# EasyEDA schematic SCH_A320 OVHD Lights_2023-04-26.json
TITLE: A320 Overhead - Lights; REV: 1.0; Date: 2021-09-25; Sheet: 1/1; Drawn By: MadMonkeyFPV\nShane Sewell
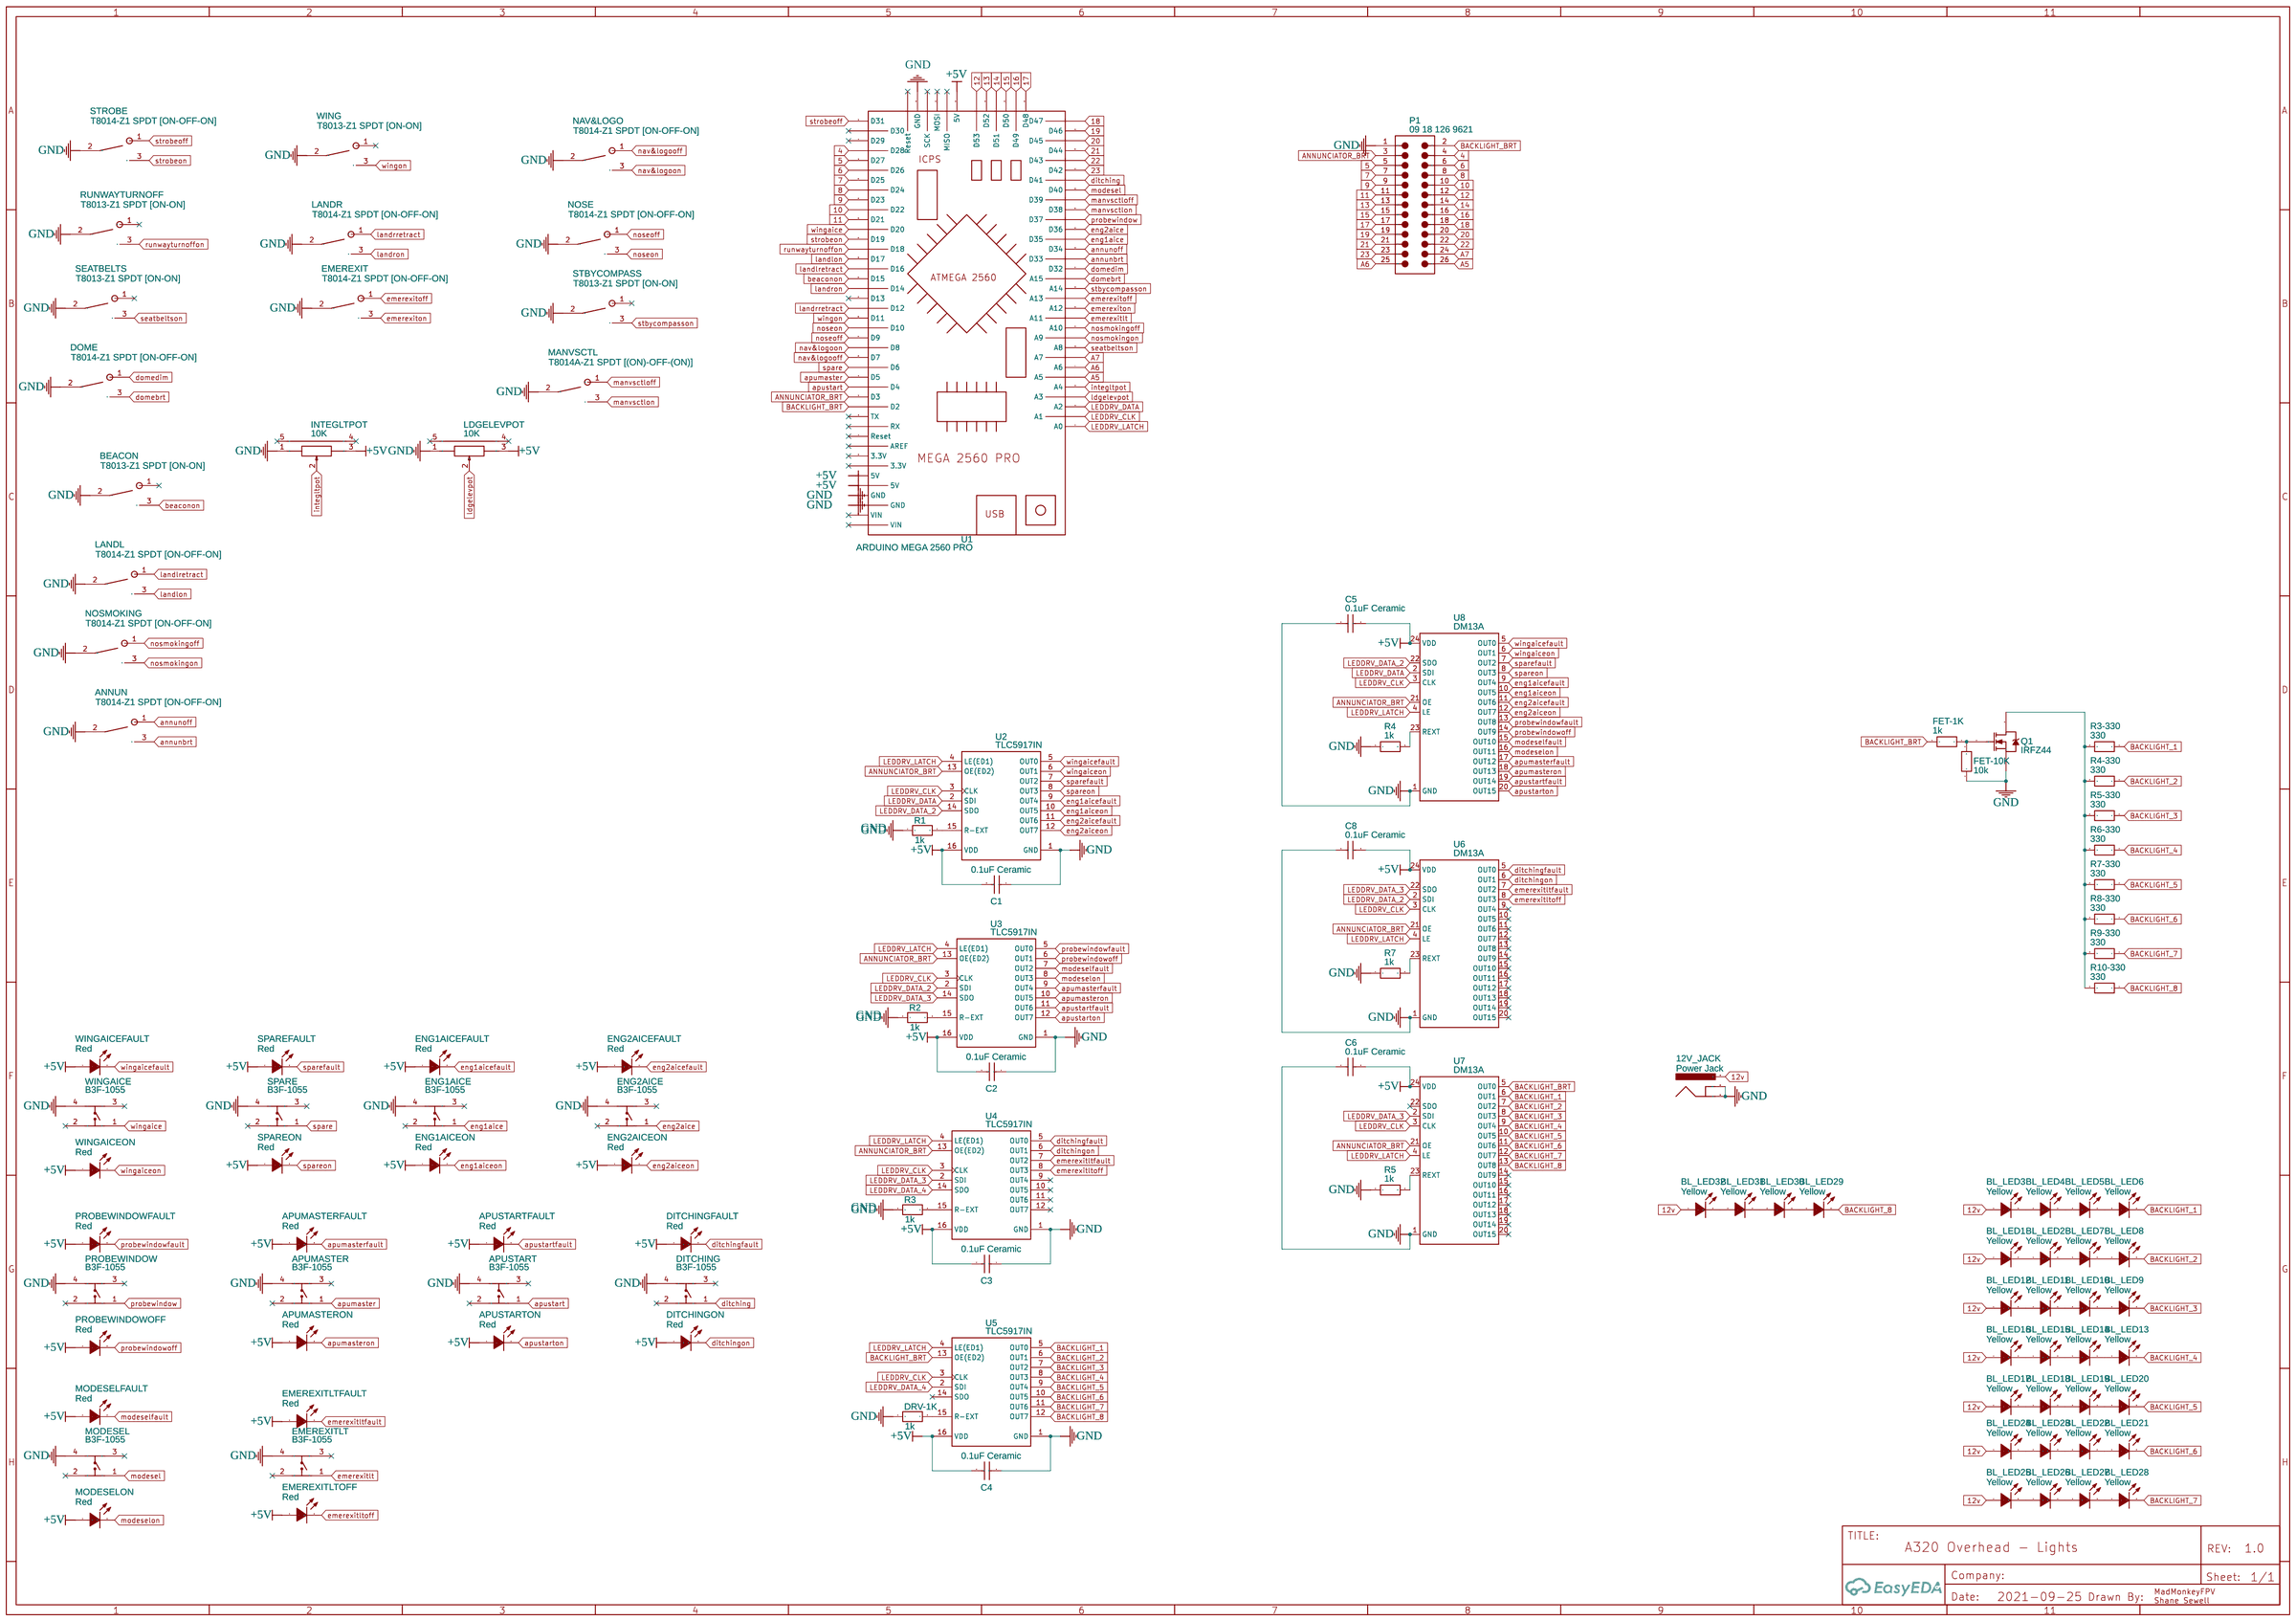
[diagram p0: schematic sheet]

## Parts
12V_JACK  Power Jack  [BARREL_JACK_SLOTTED_HOLES]
ANNUN  T8014-Z1 SPDT [ON-OFF-ON]  [SH T80-T 3 PIN]
APUMASTER  B3F-1055  [KEY-TH_4P-L6.0-W6.0-P4.50]
APUMASTERFAULT  Red  [LED-TH_BD3.0_GREEN]
APUMASTERON  Red  [LED-TH_BD3.0_GREEN]
APUSTART  B3F-1055  [KEY-TH_4P-L6.0-W6.0-P4.50]
APUSTARTFAULT  Red  [LED-TH_BD3.0_GREEN]
APUSTARTON  Red  [LED-TH_BD3.0_GREEN]
BEACON  T8013-Z1 SPDT [ON-ON]  [SH T80-T 3 PIN]
BL_LED1  Yellow  [LED-TH_BD3.0_RED]
BL_LED2  Yellow  [LED-TH_BD3.0_RED]
BL_LED3  Yellow  [LED-TH_BD3.0_RED]
BL_LED4  Yellow  [LED-TH_BD3.0_RED]
BL_LED5  Yellow  [LED-TH_BD3.0_RED]
BL_LED6  Yellow  [LED-TH_BD3.0_RED]
BL_LED7  Yellow  [LED-TH_BD3.0_RED]
BL_LED8  Yellow  [LED-TH_BD3.0_RED]
BL_LED9  Yellow  [LED-TH_BD3.0_RED]
BL_LED10  Yellow  [LED-TH_BD3.0_RED]
BL_LED11  Yellow  [LED-TH_BD3.0_RED]
BL_LED12  Yellow  [LED-TH_BD3.0_RED]
BL_LED13  Yellow  [LED-TH_BD3.0_RED]
BL_LED14  Yellow  [LED-TH_BD3.0_RED]
BL_LED15  Yellow  [LED-TH_BD3.0_RED]
BL_LED16  Yellow  [LED-TH_BD3.0_RED]
BL_LED17  Yellow  [LED-TH_BD3.0_RED]
BL_LED18  Yellow  [LED-TH_BD3.0_RED]
BL_LED19  Yellow  [LED-TH_BD3.0_RED]
BL_LED20  Yellow  [LED-TH_BD3.0_RED]
BL_LED21  Yellow  [LED-TH_BD3.0_RED]
BL_LED22  Yellow  [LED-TH_BD3.0_RED]
BL_LED23  Yellow  [LED-TH_BD3.0_RED]
BL_LED24  Yellow  [LED-TH_BD3.0_RED]
BL_LED25  Yellow  [LED-TH_BD3.0_RED]
BL_LED26  Yellow  [LED-TH_BD3.0_RED]
BL_LED27  Yellow  [LED-TH_BD3.0_RED]
BL_LED28  Yellow  [LED-TH_BD3.0_RED]
BL_LED29  Yellow  [LED-TH_BD3.0_RED]
BL_LED30  Yellow  [LED-TH_BD3.0_RED]
BL_LED31  Yellow  [LED-TH_BD3.0_RED]
BL_LED32  Yellow  [LED-TH_BD3.0_RED]
C1  0.1uF Ceramic  [CERAMIC CAPACITOR]
C2  0.1uF Ceramic  [CERAMIC CAPACITOR]
C3  0.1uF Ceramic  [CERAMIC CAPACITOR]
C4  0.1uF Ceramic  [CERAMIC CAPACITOR]
C5  0.1uF Ceramic  [CERAMIC CAPACITOR]
C6  0.1uF Ceramic  [CERAMIC CAPACITOR]
C8  0.1uF Ceramic  [CERAMIC CAPACITOR]
DITCHING  B3F-1055  [KEY-TH_4P-L6.0-W6.0-P4.50]
DITCHINGFAULT  Red  [LED-TH_BD3.0_GREEN]
DITCHINGON  Red  [LED-TH_BD3.0_GREEN]
DOME  T8014-Z1 SPDT [ON-OFF-ON]  [SH T80-T 3 PIN]
DRV-1K  1k  [R_AXIAL-0.3]
EMEREXIT  T8014-Z1 SPDT [ON-OFF-ON]  [SH T80-T 3 PIN]
EMEREXITLT  B3F-1055  [KEY-TH_4P-L6.0-W6.0-P4.50]
EMEREXITLTFAULT  Red  [LED-TH_BD3.0_GREEN]
EMEREXITLTOFF  Red  [LED-TH_BD3.0_GREEN]
ENG1AICE  B3F-1055  [KEY-TH_4P-L6.0-W6.0-P4.50]
ENG1AICEFAULT  Red  [LED-TH_BD3.0_GREEN]
ENG1AICEON  Red  [LED-TH_BD3.0_GREEN]
ENG2AICE  B3F-1055  [KEY-TH_4P-L6.0-W6.0-P4.50]
ENG2AICEFAULT  Red  [LED-TH_BD3.0_GREEN]
ENG2AICEON  Red  [LED-TH_BD3.0_GREEN]
FET-1K  1k  [R_AXIAL-0.3]
FET-10K  10k  [R_AXIAL-0.3]
INTEGLTPOT  10K  [RES-TH_RK09K1130A70]
LANDL  T8014-Z1 SPDT [ON-OFF-ON]  [SH T80-T 3 PIN]
LANDR  T8014-Z1 SPDT [ON-OFF-ON]  [SH T80-T 3 PIN]
LDGELEVPOT  10K  [RES-TH_RK09K1130A70]
MANVSCTL  T8014A-Z1 SPDT [(ON)-OFF-(ON)]  [SH T80-T 3 PIN]
MODESEL  B3F-1055  [KEY-TH_4P-L6.0-W6.0-P4.50]
MODESELFAULT  Red  [LED-TH_BD3.0_GREEN]
MODESELON  Red  [LED-TH_BD3.0_GREEN]
NAV&LOGO  T8014-Z1 SPDT [ON-OFF-ON]  [SH T80-T 3 PIN]
NOSE  T8014-Z1 SPDT [ON-OFF-ON]  [SH T80-T 3 PIN]
NOSMOKING  T8014-Z1 SPDT [ON-OFF-ON]  [SH T80-T 3 PIN]
P1  09 18 126 9621  [9181269621]
PROBEWINDOW  B3F-1055  [KEY-TH_4P-L6.0-W6.0-P4.50]
PROBEWINDOWFAULT  Red  [LED-TH_BD3.0_GREEN]
PROBEWINDOWOFF  Red  [LED-TH_BD3.0_GREEN]
Q1  IRFZ44  [TO-220AB]
R1  1k  [R_AXIAL-0.3]
R2  1k  [R_AXIAL-0.3]
R3  1k  [R_AXIAL-0.3]
R3-330  330  [R_AXIAL-0.3]
R4  1k  [R_AXIAL-0.3]
R4-330  330  [R_AXIAL-0.3]
R5  1k  [R_AXIAL-0.3]
R5-330  330  [R_AXIAL-0.3]
R6-330  330  [R_AXIAL-0.3]
R7  1k  [R_AXIAL-0.3]
R7-330  330  [R_AXIAL-0.3]
R8-330  330  [R_AXIAL-0.3]
R9-330  330  [R_AXIAL-0.3]
R10-330  330  [R_AXIAL-0.3]
RUNWAYTURNOFF  T8013-Z1 SPDT [ON-ON]  [SH T80-T 3 PIN]
SEATBELTS  T8013-Z1 SPDT [ON-ON]  [SH T80-T 3 PIN]
SPARE  B3F-1055  [KEY-TH_4P-L6.0-W6.0-P4.50]
SPAREFAULT  Red  [LED-TH_BD3.0_GREEN]
SPAREON  Red  [LED-TH_BD3.0_GREEN]
STBYCOMPASS  T8013-Z1 SPDT [ON-ON]  [SH T80-T 3 PIN]
STROBE  T8014-Z1 SPDT [ON-OFF-ON]  [SH T80-T 3 PIN]
U1  ARDUINO MEGA 2560 PRO  [ARDUINO MEGA 2560 PRO]
U2  TLC5917IN  [DIP16]
U3  TLC5917IN  [DIP16]
U4  TLC5917IN  [DIP16]
U5  TLC5917IN  [DIP16]
U6  DM13A  [DIP24]
U7  DM13A  [DIP24]
U8  DM13A  [DIP24]
WING  T8013-Z1 SPDT [ON-ON]  [SH T80-T 3 PIN]
WINGAICE  B3F-1055  [KEY-TH_4P-L6.0-W6.0-P4.50]
WINGAICEFAULT  Red  [LED-TH_BD3.0_GREEN]
WINGAICEON  Red  [LED-TH_BD3.0_GREEN]

## Library data of the parts
12V_JACK = POWER_JACK: Contributor: SparkFun; Supplier: Tayda Electronics; Supplier Part: A-4118; Manufacturer: Wealth Metal; Package Display: No
ANNUN BEACON DOME EMEREXIT LANDL LANDR MANVSCTL NAV&LOGO NOSE NOSMOKING RUNWAYTURNOFF SEATBELTS STBYCOMPASS STROBE WING = T8014-LK SPDT [ON-OFF-ON]: Supplier: AliExpress; link: https://www.aliexpress.com/item/4000392737042.html; Contributor: ssewell
APUMASTER APUSTART DITCHING EMEREXITLT ENG1AICE ENG2AICE MODESEL PROBEWINDOW SPARE WINGAICE = B3F-1055: Supplier: LCSC; Manufacturer: OMRON; Manufacturer Part: B3F-1052; Supplier Part: C87037; JLCPCB Part Class: Extended Part
APUMASTERFAULT APUMASTERON APUSTARTFAULT APUSTARTON BL_LED1-BL_LED32 DITCHINGFAULT DITCHINGON EMEREXITLTFAULT EMEREXITLTOFF ENG1AICEFAULT ENG1AICEON ENG2AICEFAULT ENG2AICEON MODESELFAULT MODESELON PROBEWINDOWFAULT PROBEWINDOWOFF SPAREFAULT SPAREON WINGAICEFAULT WINGAICEON = LED-TH-3mm_R: Manufacturer: EVERLIGHT(台湾亿光); Manufacturer Part: 204-10SDRD/S530-A3-L; Supplier Part: C84774; Supplier: LCSC; Contributor: LCEDA_Lib
C1-C6 C8 = Capacitor_Ceramic: Contributor: amit071089
DRV-1K FET-1K FET-10K R1-R3 R3-330 R4 R4-330 R5 R5-330 R6-330 R7 R7-330 R8-330 R9-330 R10-330 = R_AXIAL-0.3_EU: Contributor: LCEDA_Lib
INTEGLTPOT LDGELEVPOT = RK09K1130A70: Supplier: LCSC; Supplier Part: C351173; Manufacturer: ALPS Electric; Contributor: LCSC; JLCPCB Part Class: Extended Part
P1 = 09 18 126 9621: Flat Cable Connector (IDC), PCB Transition Connector, 2 Rows, Solder Pin, 26 Contacts
Q1 = IRFZ44: HEXFET N-Channel Power MOSFET
U1 = ARDUINO MEGA 2560 PRO: Manufacturer Part: Arduino Mega 2560 Pro Mini; link: https://www.arduino.cc; Contributor: DEVAZ
U2-U5 = TLC5917IN: 8-Bit Constant-Current LED Sink Driver, 3 to 5.5 V, -40 to 125 degC, 16-pin DIP (N16), Pb-Free (RoHS)
U6-U8 = DM13A

## Nets
12v: 12V_JACK.PWR BL_LED1.1 BL_LED3.1 BL_LED12.1 BL_LED16.1 BL_LED17.1 BL_LED24.1 BL_LED25.1 BL_LED32.1
+5V: APUMASTERFAULT.1 APUMASTERON.1 APUSTARTFAULT.1 APUSTARTON.1 C1.2 C2.2 C3.2 C4.2 C5.2 C6.2 C8.2 DITCHINGFAULT.1 DITCHINGON.1 EMEREXITLTFAULT.1 EMEREXITLTOFF.1 ENG1AICEFAULT.1 ENG1AICEON.1 ENG2AICEFAULT.1 ENG2AICEON.1 INTEGLTPOT.3 LDGELEVPOT.3 MODESELFAULT.1 MODESELON.1 PROBEWINDOWFAULT.1 PROBEWINDOWOFF.1 SPAREFAULT.1 SPAREON.1 U1.39(5V) U1.81(5V) U1.82(5V) U2.16(VDD) U3.16(VDD) U4.16(VDD) U5.16(VDD) U6.24(VDD) U7.24(VDD) U8.24(VDD) WINGAICEFAULT.1 WINGAICEON.1
GND: 12V_JACK.GND 12V_JACK.GNDBREAK ANNUN.2 APUMASTER.4 APUSTART.4 BEACON.2 C1.1 C2.1 C3.1 C4.1 C5.1 C6.1 C8.1 DITCHING.4 DOME.2 DRV-1K.1 EMEREXIT.2 EMEREXITLT.4 ENG1AICE.4 ENG2AICE.4 FET-10K.1 INTEGLTPOT.1 LANDL.2 LANDR.2 LDGELEVPOT.1 MANVSCTL.2 MODESEL.4 NAV&LOGO.2 NOSE.2 NOSMOKING.2 P1.1(GND) PROBEWINDOW.4 Q1.3(S) R1.1 R2.1 R3.1 R4.1 R5.1 R7.1 RUNWAYTURNOFF.2 SEATBELTS.2 SPARE.4 STBYCOMPASS.2 STROBE.2 U1.43(GND) U1.83(GND) U1.84(GND) U2.1(GND) U3.1(GND) U4.1(GND) U5.1(GND) U6.1(GND) U7.1(GND) U8.1(GND) WING.2 WINGAICE.4
4: P1.4 U1.48(D28)
5: P1.5 U1.49(D27)
6: P1.6 U1.50(D26)
7: P1.7 U1.51(D25)
8: P1.8 U1.52(D24)
9: P1.9 U1.53(D23)
10: P1.10 U1.54(D22)
11: P1.11 U1.55(D21)
12: P1.12 U1.38(D53)
13: P1.13 U1.37(D52)
14: P1.14 U1.36(D51)
15: P1.15 U1.35(D50)
16: P1.16 U1.34(D49)
17: P1.17 U1.33(D48)
18: P1.18 U1.32(D47)
19: P1.19 U1.31(D46)
20: P1.20 U1.30(D45)
21: P1.21 U1.29(D44)
22: P1.22 U1.28(D43)
23: P1.23 U1.27(D42)
A5: P1.26(A5) U1.6(A5)
A6: P1.25(A6) U1.7(A6)
A7: P1.24(A7) U1.8(A7)
annunbrt: ANNUN.3 U1.18(D33)
ANNUNCIATOR_BRT: P1.3 U1.73(D3) U2.13(OE(ED2)) U3.13(OE(ED2)) U4.13(OE(ED2)) U6.21(OE) U7.21(OE) U8.21(OE)
annunoff: ANNUN.1 U1.19(D34)
apumaster: APUMASTER.1 U1.71(D5)
apumasterfault: APUMASTERFAULT.2 U3.9(OUT4) U8.17(OUT12)
apumasteron: APUMASTERON.2 U3.10(OUT5) U8.18(OUT13)
apustart: APUSTART.1 U1.72(D4)
apustartfault: APUSTARTFAULT.2 U3.11(OUT6) U8.19(OUT14)
apustarton: APUSTARTON.2 U3.12(OUT7) U8.20(OUT15)
BACKLIGHT_1: BL_LED6.2 R3-330.1 U5.5(OUT0) U7.6(OUT1)
BACKLIGHT_2: BL_LED8.2 R4-330.1 U5.6(OUT1) U7.7(OUT2)
BACKLIGHT_3: BL_LED9.2 R5-330.1 U5.7(OUT2) U7.8(OUT3)
BACKLIGHT_4: BL_LED13.2 R6-330.1 U5.8(OUT3) U7.9(OUT4)
BACKLIGHT_5: BL_LED20.2 R7-330.1 U5.9(OUT4) U7.10(OUT5)
BACKLIGHT_6: BL_LED21.2 R8-330.1 U5.10(OUT5) U7.11(OUT6)
BACKLIGHT_7: BL_LED28.2 R9-330.1 U5.11(OUT6) U7.12(OUT7)
BACKLIGHT_8: BL_LED29.2 R10-330.1 U5.12(OUT7) U7.13(OUT8)
BACKLIGHT_BRT: FET-1K.2 P1.2 U1.74(D2) U5.13(OE(ED2)) U7.5(OUT0)
beaconon: BEACON.3 U1.61(D15)
ditching: DITCHING.1 U1.26(D41)
ditchingfault: DITCHINGFAULT.2 U4.5(OUT0) U6.5(OUT0)
ditchingon: DITCHINGON.2 U4.6(OUT1) U6.6(OUT1)
domebrt: DOME.3 U1.16(A15)
domedim: DOME.1 U1.17(D32)
emerexitlt: EMEREXITLT.1 U1.12(A11)
emerexitltfault: EMEREXITLTFAULT.2 U4.7(OUT2) U6.7(OUT2)
emerexitltoff: EMEREXITLTOFF.2 U4.8(OUT3) U6.8(OUT3)
emerexitoff: EMEREXIT.1 U1.14(A13)
emerexiton: EMEREXIT.3 U1.13(A12)
eng1aice: ENG1AICE.1 U1.20(D35)
eng1aicefault: ENG1AICEFAULT.2 U2.9(OUT4) U8.9(OUT4)
eng1aiceon: ENG1AICEON.2 U2.10(OUT5) U8.10(OUT5)
eng2aice: ENG2AICE.1 U1.21(D36)
eng2aicefault: ENG2AICEFAULT.2 U2.11(OUT6) U8.11(OUT6)
eng2aiceon: ENG2AICEON.2 U2.12(OUT7) U8.12(OUT7)
integltpot: INTEGLTPOT.2 U1.5(A4)
landlon: LANDL.3 U1.59(D17)
landlretract: LANDL.1 U1.60(D16)
landron: LANDR.3 U1.62(D14)
landrretract: LANDR.1 U1.64(D12)
ldgelevpot: LDGELEVPOT.2 U1.4(A3)
LEDDRV_CLK: U1.2(A1) U2.3(CLK) U3.3(CLK) U4.3(CLK) U5.3(CLK) U6.3(CLK) U7.3(CLK) U8.3(CLK)
LEDDRV_DATA: U1.3(A2) U2.2(SDI) U8.2(SDI)
LEDDRV_DATA_2: U2.14(SDO) U3.2(SDI) U6.2(SDI) U8.22(SDO)
LEDDRV_DATA_3: U3.14(SDO) U4.2(SDI) U6.22(SDO) U7.2(SDI)
LEDDRV_DATA_4: U4.14(SDO) U5.2(SDI)
LEDDRV_LATCH: U1.1(A0) U2.4(LE(ED1)) U3.4(LE(ED1)) U4.4(LE(ED1)) U5.4(LE(ED1)) U6.4(LE) U7.4(LE) U8.4(LE)
manvsctloff: MANVSCTL.1 U1.24(D39)
manvsctlon: MANVSCTL.3 U1.23(D38)
modesel: MODESEL.1 U1.25(D40)
modeselfault: MODESELFAULT.2 U3.7(OUT2) U8.15(OUT10)
modeselon: MODESELON.2 U3.8(OUT3) U8.16(OUT11)
nav&logooff: NAV&LOGO.1 U1.69(D7)
nav&logoon: NAV&LOGO.3 U1.68(D8)
noseoff: NOSE.1 U1.67(D9)
noseon: NOSE.3 U1.66(D10)
nosmokingoff: NOSMOKING.1 U1.11(A10)
nosmokingon: NOSMOKING.3 U1.10(A9)
probewindow: PROBEWINDOW.1 U1.22(D37)
probewindowfault: PROBEWINDOWFAULT.2 U3.5(OUT0) U8.13(OUT8)
probewindowoff: PROBEWINDOWOFF.2 U3.6(OUT1) U8.14(OUT9)
runwayturnoffon: RUNWAYTURNOFF.3 U1.58(D18)
seatbeltson: SEATBELTS.3 U1.9(A8)
spare: SPARE.1 U1.70(D6)
sparefault: SPAREFAULT.2 U2.7(OUT2) U8.7(OUT2)
spareon: SPAREON.2 U2.8(OUT3) U8.8(OUT3)
stbycompasson: STBYCOMPASS.3 U1.15(A14)
strobeoff: STROBE.1 U1.45(D31)
strobeon: STROBE.3 U1.57(D19)
wingaice: U1.56(D20) WINGAICE.1
wingaicefault: U2.5(OUT0) U8.5(OUT0) WINGAICEFAULT.2
wingaiceon: U2.6(OUT1) U8.6(OUT1) WINGAICEON.2
wingon: U1.65(D11) WING.3
Net-(BL_LED1-2): BL_LED1.2 BL_LED2.1
Net-(BL_LED2-2): BL_LED2.2 BL_LED7.1
Net-(BL_LED3-2): BL_LED3.2 BL_LED4.1
Net-(BL_LED4-2): BL_LED4.2 BL_LED5.1
Net-(BL_LED5-2): BL_LED5.2 BL_LED6.1
Net-(BL_LED7-2): BL_LED7.2 BL_LED8.1
Net-(BL_LED9-1): BL_LED9.1 BL_LED10.2
Net-(BL_LED10-1): BL_LED10.1 BL_LED11.2
Net-(BL_LED11-1): BL_LED11.1 BL_LED12.2
Net-(BL_LED13-1): BL_LED13.1 BL_LED14.2
Net-(BL_LED14-1): BL_LED14.1 BL_LED15.2
Net-(BL_LED15-1): BL_LED15.1 BL_LED16.2
Net-(BL_LED17-2): BL_LED17.2 BL_LED18.1
Net-(BL_LED18-2): BL_LED18.2 BL_LED19.1
Net-(BL_LED19-2): BL_LED19.2 BL_LED20.1
Net-(BL_LED21-1): BL_LED21.1 BL_LED22.2
Net-(BL_LED22-1): BL_LED22.1 BL_LED23.2
Net-(BL_LED23-1): BL_LED23.1 BL_LED24.2
Net-(BL_LED25-2): BL_LED25.2 BL_LED26.1
Net-(BL_LED26-2): BL_LED26.2 BL_LED27.1
Net-(BL_LED27-2): BL_LED27.2 BL_LED28.1
Net-(BL_LED29-1): BL_LED29.1 BL_LED30.2
Net-(BL_LED30-1): BL_LED30.1 BL_LED31.2
Net-(BL_LED31-1): BL_LED31.1 BL_LED32.2
Net-(DRV-1K-2): DRV-1K.2 U5.15(R-EXT)
Net-(FET-1K-1): FET-1K.1 FET-10K.2 Q1.1(G)
Net-(Q1-2): Q1.2(D) R3-330.2 R4-330.2 R5-330.2 R6-330.2 R7-330.2 R8-330.2 R9-330.2 R10-330.2
Net-(R1-2): R1.2 U2.15(R-EXT)
Net-(R2-2): R2.2 U3.15(R-EXT)
Net-(R3-2): R3.2 U4.15(R-EXT)
Net-(R4-2): R4.2 U8.23(REXT)
Net-(R5-2): R5.2 U7.23(REXT)
Net-(R7-2): R7.2 U6.23(REXT)

Not connected (* = marked no-connect by the designer): APUMASTER 2* 3*; APUSTART 2* 3*; BEACON 1*; DITCHING 2* 3*; EMEREXITLT 2* 3*; ENG1AICE 2* 3*; ENG2AICE 2* 3*; INTEGLTPOT 4(EH)* 5(EH)*; LDGELEVPOT 4(EH)* 5(EH)*; MODESEL 2* 3*; PROBEWINDOW 2* 3*; RUNWAYTURNOFF 1*; SEATBELTS 1*; SPARE 2* 3*; STBYCOMPASS 1*; U1 40(MISO)* 41(MOSI)* 42(SCK)* 44(Reset)* 46(D30)* 47(D29)* 63(D13)* 75(TX)* 76(RX)* 77(Reset)* 78(AREF)* 79(3.3V)* 80(3.3V)* 85(VIN)* 86(VIN)*; U4 9(OUT4)* 10(OUT5)* 11(OUT6)* 12(OUT7)*; U5 14(SDO)*; U6 9(OUT4)* 10(OUT5)* 11(OUT6)* 12(OUT7)* 13(OUT8)* 14(OUT9)* 15(OUT10)* 16(OUT11)* 17(OUT12)* 18(OUT13)* 19(OUT14)* 20(OUT15)*; U7 14(OUT9)* 15(OUT10)* 16(OUT11)* 17(OUT12)* 18(OUT13)* 19(OUT14)* 20(OUT15)* 22(SDO)*; WING 1*; WINGAICE 2* 3*

## Notes on the sheet
- GND
- GND
- GND
